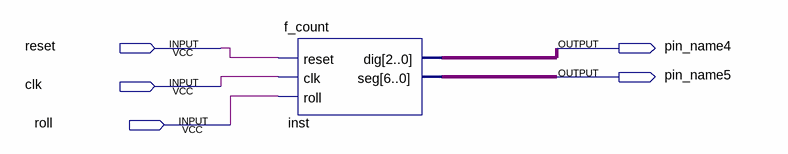
[diagram p0: schematic sheet]
// Quartus schematic test1.bdf as structural Verilog: 1 symbols, 5 pins
module test1 (
  input  reset,
  input  clk,
  input  roll,
  output pin_name4,
  output pin_name5
);

  wire [2:0] inst_dig;
  wire [6:0] inst_seg;

  f_count inst (.reset(reset), .clk(clk), .roll(roll), .dig(inst_dig), .seg(inst_seg));
endmodule
